# EAGLE schematic DIS07050H-V2.0-20231201 (EAGLE 9.5.1)
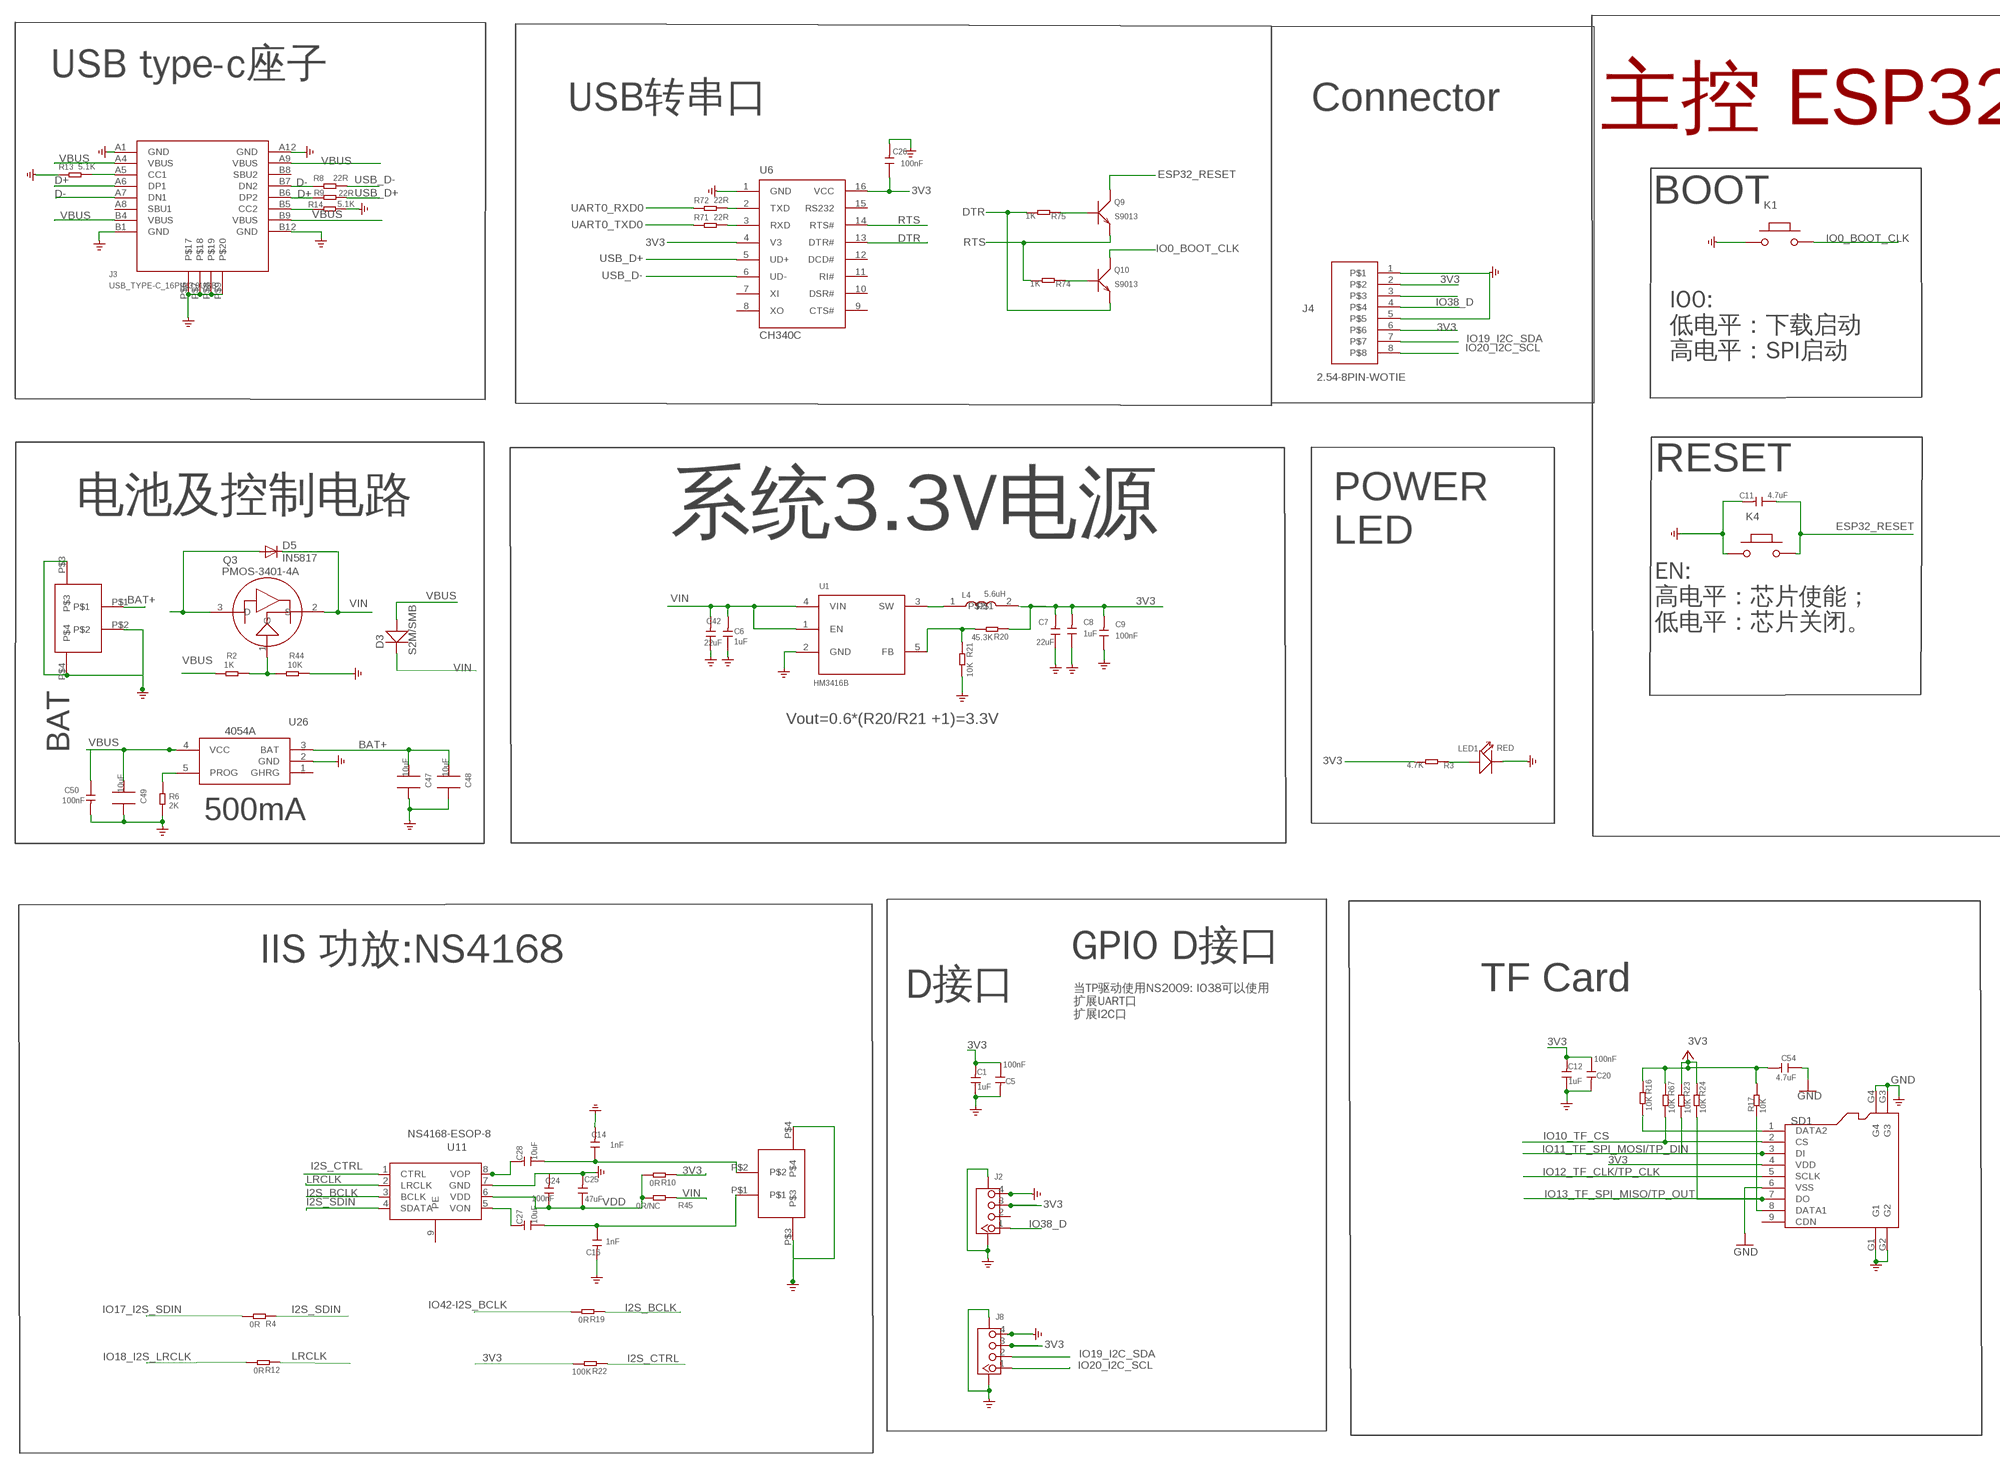
[diagram p0: schematic, sheet 1, part 1 of 2]
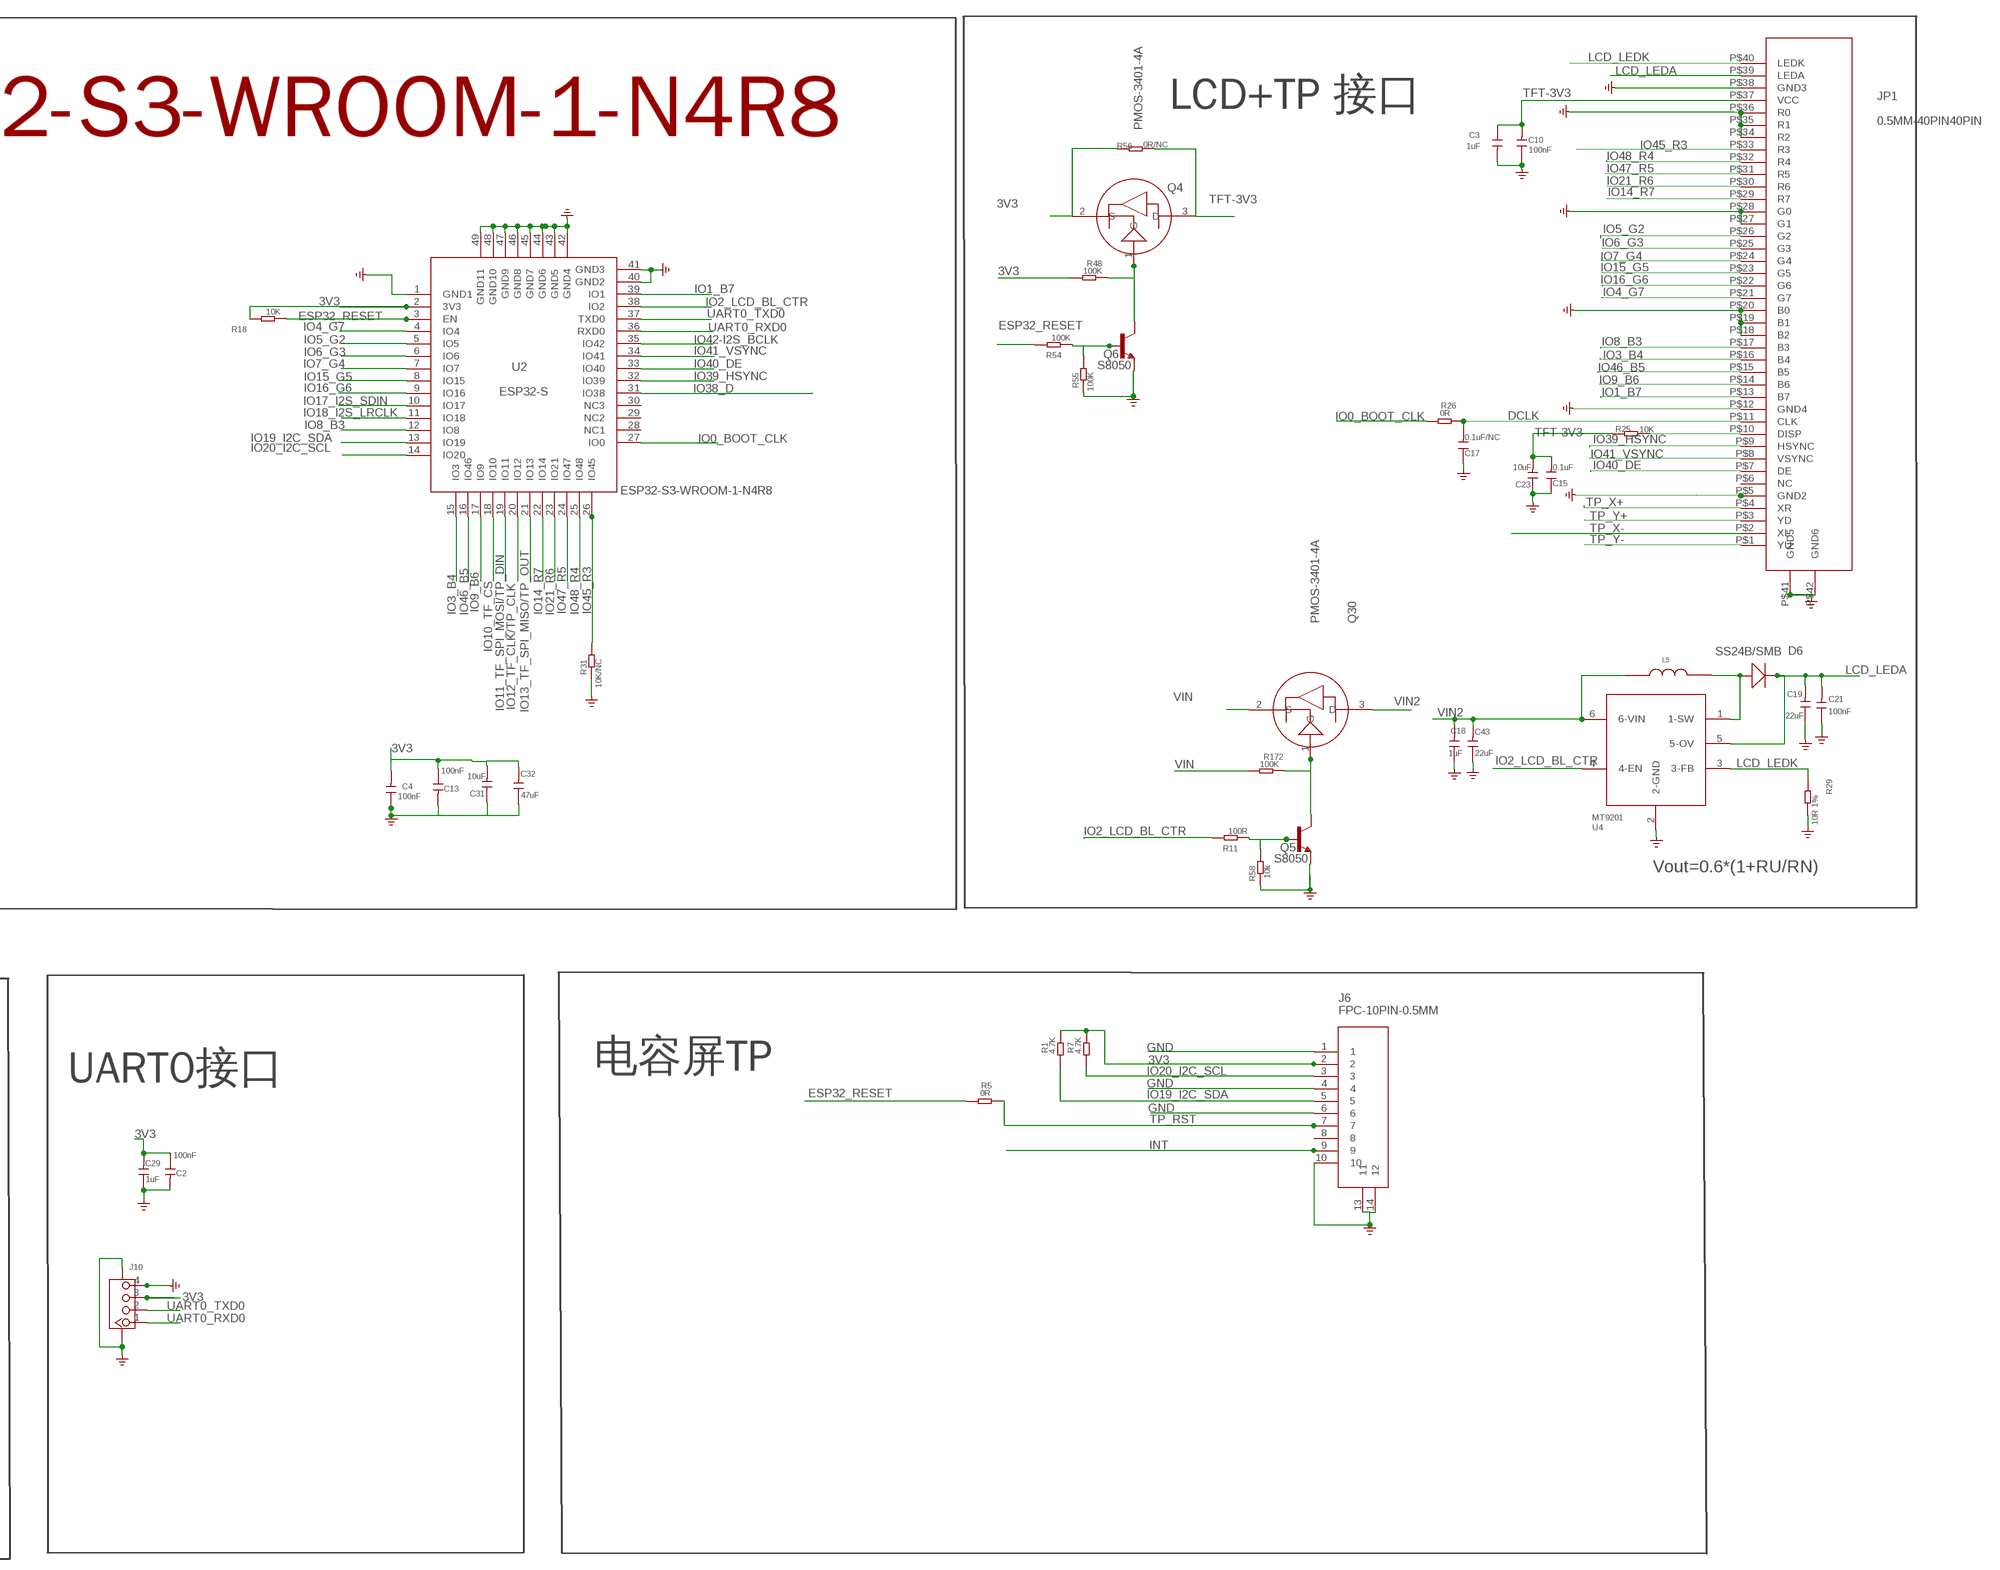
[diagram p1: schematic, sheet 1, part 2 of 2]

## Parts
C1  1uF  DISCRETE_C-0603  [DISCRETE_C0603]
C2  100nF  C-0603  [C0603]
C3  1uF  C-0603  [C0603]
C4  100nF  C-0603  [C0603]
C5  100nF  C-0603  [C0603]
C6  1uF  C0603  [0603]
C7  22uF  C0805  [0805]
C8  1uF  C0603  [0603]
C9  100nF  C0603  [0603]
C10  100nF  C-0603  [C0603]
C11  4.7uF  C0603  [0603]
C12  1uF  DISCRETE_C-0603  [DISCRETE_C0603]
C13  100nF  C-0603  [C0603]
C14  1nF  C-0603  [C0603]
C15  0.1uF  DISCRETE_C-0603  [DISCRETE_C0603]
C16  1nF  C-0603  [C0603]
C17  0.1uF/NC  DISCRETE_C-0603  [DISCRETE_C0603]
C18  1uF  C0603  [0603]
C19  22uF  C0805  [0805]
C20  100nF  C-0603  [C0603]
C21  100nF  C0603  [0603]
C23  10uF  DISCRETE_C-0603  [DISCRETE_C0603]
C24  100nF  C-0603  [C0603]
C25  47uF  C0805  [0805]
C26  100nF  C0603  [0603]
C27  10uF  DISCRETE_C-0603  [DISCRETE_C0603]
C28  10uF  DISCRETE_C-0603  [DISCRETE_C0603]
C29  1uF  DISCRETE_C-0603  [DISCRETE_C0603]
C31  10uF  DISCRETE_C-0603  [DISCRETE_C0603]
C32  47uF  C0805  [0805]
C42  22uF  C0805  [0805]
C43  22uF  C0805  [0805]
C47  10uF  C0805_S  [0805_S]
C48  10uF  C0805_S  [0805_S]
C49  10uF  C0805_S  [0805_S]
C50  100nF  C-0603  [C0603]
C54  4.7uF  DISCRETE_C-0603  [DISCRETE_C0603]
D3  S2M/SMB  214ABDO-214AB  [214AB]
D5  IN5817  DIODE-DO-214AC  [DO-214AC]
D6  SS24B/SMB  214ABDO-214AB  [214AB]
J1  PH2.0WT-2PIN  [PH2.0WT-2PIN]
J2  CONNECTOR_TWIG-4P-2.0-SMD-FEMALE-REINFORCE90D  [CONNECTOR_4P-SMD-2.0-90D]
J3  USB_TYPE-C_16PIN3.0USB  [KEVIN_3.0TYPEC-SMD]
J4  2.54-8PIN-WOTIE  [2.54-8P-WOTIE]
J5  PH2.0WT-2PIN  [PH2.0WT-2PIN]
J6  FPC-10PIN-0.5MM  [FPC-10PIN-0.5MM]
J8  CONNECTOR_TWIG-4P-2.0-SMD-FEMALE-REINFORCE90D  [CONNECTOR_4P-SMD-2.0-90D]
J10  CONNECTOR_TWIG-4P-2.0-SMD-FEMALE-REINFORCE90D  [CONNECTOR_4P-SMD-2.0-90D]
JP1  0.5MM-40PIN40PIN  [0.5MM*40P]
K1  BUTTON  PB157  [157SW]
K4  BUTTON  PB157  [157SW]
L4  5.6uH  L-0530  [CD54_CD54]
L5  CD32_6.8uH  CD32_950MA  [CD32]
LED1  RED  DISCRETE_LED0603  [DISCRETE_LED-0603]
Q3  PMOS-3401-4A  P-MOS-SOT23  [SOT-23]
Q4  PMOS-3401-4A  P-MOS-SOT23  [SOT-23]
Q5  S8050  SPARKFUN_TRANSISTOR_NPNSOT23  [SPARKFUN_SOT23]
Q6  S8050  SPARKFUN_TRANSISTOR_NPNSOT23  [SPARKFUN_SOT23]
Q9  S9013  TRANSISTOR-NPN-SOT23  [SOT23@1]
Q10  S9013  TRANSISTOR-NPN-SOT23  [SOT23@1]
Q30  PMOS-3401-4A  P-MOS-SOT23  [SOT-23]
R1  4.7K  R-0603  [R0603]
R2  1K  DISCRETE_R-0603  [DISCRETE_R0603]
R3  4.7K  DISCRETE_R-0603  [DISCRETE_R0603]
R4  0R  DISCRETE_R-0603  [DISCRETE_R0603]
R5  0R  R-0603  [R0603]
R6  2K  DISCRETE_R-0603  [DISCRETE_R0603]
R7  4.7K  R-0603  [R0603]
R8  22R  DISCRETE_R-0603  [DISCRETE_R0603]
R9  22R  DISCRETE_R-0603  [DISCRETE_R0603]
R10  0R  DISCRETE_R-0603  [DISCRETE_R0603]
R11  100R  R0603  [R0603]
R12  0R  DISCRETE_R-0603  [DISCRETE_R0603]
R13  5.1K  DISCRETE_R-0603  [DISCRETE_R0603]
R14  5.1K  DISCRETE_R-0603  [DISCRETE_R0603]
R16  10K  DISCRETE_R-0603  [DISCRETE_R0603]
R17  10K  DISCRETE_R-0603  [DISCRETE_R0603]
R18  10K  DISCRETE_R-0603  [DISCRETE_R0603]
R19  0R  DISCRETE_R-0603  [DISCRETE_R0603]
R20  45.3K  DISCRETE_R-0603  [DISCRETE_R0603]
R21  10K  DISCRETE_R-0603  [DISCRETE_R0603]
R22  100K  DISCRETE_R-0603  [DISCRETE_R0603]
R23  10K  DISCRETE_R-0603  [DISCRETE_R0603]
R24  10K  DISCRETE_R-0603  [DISCRETE_R0603]
R25  10K  DISCRETE_R-0603  [DISCRETE_R0603]
R26  0R  R-0603  [R0603]
R29  10R 1%  DISCRETE_R-0603  [DISCRETE_R0603]
R31  10K/NC  R0603  [R0603]
R44  10K  DISCRETE_R-0603  [DISCRETE_R0603]
R45  0R/NC  DISCRETE_R-0603  [DISCRETE_R0603]
R48  100K  R-0603  [R0603]
R54  100K  R0603  [R0603]
R55  100K  R0603  [R0603]
R56  0R/NC  DISCRETE_R-0603  [DISCRETE_R0603]
R58  10k  R0603  [R0603]
R67  10K  DISCRETE_R-0603  [DISCRETE_R0603]
R71  22R  DISCRETE_R-0603  [DISCRETE_R0603]
R72  22R  DISCRETE_R-0603  [DISCRETE_R0603]
R74  1K  DISCRETE_R-0603  [DISCRETE_R0603]
R75  1K  DISCRETE_R-0603  [DISCRETE_R0603]
R172  100K  R-0603  [R0603]
SD1  HOLDER-MICROSD-9P  [9P-SMD-W/-RING]
U1  HM3416B  A_XBJ_HM3420B  [A_XBJ_SOT23-5]
U2  ESP32-S  [ESP32-S3]
U4  MT9201  [SOT23-6]
U6  CH340C  CH340G  [SOP-16]
U11  NS4168-ESOP-8  [NS4168-ESOP-8]
U26  4054A  [SOP23-5]

## Nets
3V3: C1.2 C2.1 C4.2 C5.1 C7.2 C8.2 C9.2 C12.2 C13.1 C20.1 C26.1 C29.2 C31.2 C32.2 C54.2 J2.3 J4.2 J4.6 J6.2 J8.3 J10.3 L4.2 Q4.2(S) R1.2 R3.2 R7.2 R10.1 R16.1 R17.1 R18.1 R20.1 R22.2 R23.1 R24.1 R48.1 R56.1 R67.1 SD1.4(VDD) U2.2(3V3) U6.4(V3) U6.16(VCC) ; supply symbol labelled +3V3
BAT+: C47.2 C48.2 D5.A J1.P$1 Q3.3(D) U26.3(BAT)
D+: J3.A6(DP1) J3.B6(DP2) R9.1
D-: J3.A7(DN1) J3.B7(DN2) R8.1
DCLK: C17.2 JP1.P$11(CLK) R26.2
DTR: Q10.2(E) R75.2 U6.13(DTR#)
ESP32_RESET: C11.1 K4.2 Q9.3(C) R5.1 R18.2 R54.2 U2.3(EN)
GND: C1.1 C2.2 C3.2 C4.1 C5.2 C6.1 C7.1 C8.1 C9.1 C10.1 C11.2 C12.1 C13.2 C14.2 C15.1 C16.2 C17.1 C18.1 C19.1 C20.2 C21.1 C23.1 C24.2 C25.2 C26.2 C29.1 C31.1 C32.1 C42.1 C43.1 C47.1 C48.1 C49.1 C50.2 C54.1 J1.P$2 J1.P$3 J1.P$4 J2.4 J2.SS1 J2.SS2 J3.A1(GND) J3.A12(GND) J3.B1(GND) J3.B12(GND) J3.P$6 J3.P$7 J3.P$8 J3.P$9 J4.1 J4.5 J5.P$3 J5.P$4 J6.1 J6.4 J6.6 J6.10 J6.13 J6.14 J8.4 J8.SS1 J8.SS2 J10.4 J10.SS1 J10.SS2 JP1.P$5(GND2) JP1.P$12(GND4) JP1.P$18(B2) JP1.P$19(B1) JP1.P$20(B0) JP1.P$27(G1) JP1.P$28(G0) JP1.P$34(R2) JP1.P$35(R1) JP1.P$36(R0) JP1.P$38(GND3) JP1.P$41(GND5) JP1.P$42(GND6) K1.1 K4.1 LED1.- Q5.2(E) Q6.2(E) R6.2 R13.1 R14.2 R21.2 R29.2 R31.1 R44.1 R55.1 R58.1 SD1.6(VSS) SD1.G1 SD1.G2 SD1.G3 SD1.G4 U1.2(GND) U2.1(GND1) U2.40(GND2) U2.41(GND3) U2.42(GND4) U2.43(GND5) U2.44(GND6) U2.45(GND7) U2.46(GND8) U2.47(GND9) U2.48(GND10) U2.49(GND11) U4.2(2-GND) U6.1(GND) U11.7(GND) U26.2(GND)
I2S_BCLK: R19.1 U11.3(BCLK)
I2S_CTRL: R22.1 U11.1(CTRL)
I2S_SDIN: R4.1 U11.4(SDATA)
INT: J6.9
IO0_BOOT_CLK: K1.2 Q10.3(C) R26.1 U2.27(IO0)
IO1_B7: JP1.P$13(B7) U2.39(IO1)
IO2_LCD_BL_CTR: R11.2 U2.38(IO2) U4.4(4-EN)
IO3_B4: JP1.P$16(B4) U2.15(IO3)
IO4_G7: JP1.P$21(G7) U2.4(IO4)
IO5_G2: JP1.P$26(G2) U2.5(IO5)
IO6_G3: JP1.P$25(G3) U2.6(IO6)
IO7_G4: JP1.P$24(G4) U2.7(IO7)
IO8_B3: JP1.P$17(B3) U2.12(IO8)
IO9_B6: JP1.P$14(B6) U2.17(IO9)
IO10_TF_CS: R67.2 SD1.2(CS) U2.18(IO10)
IO11_TF_SPI_MOSI/TP_DIN: R23.2 SD1.3(DI) U2.19(IO11)
IO12_TF_CLK/TP_CLK: SD1.5(SCLK) U2.20(IO12)
IO13_TF_SPI_MISO/TP_OUT: R24.2 SD1.7(DO) U2.21(IO13)
IO14_R7: JP1.P$29(R7) U2.22(IO14)
IO15_G5: JP1.P$23(G5) U2.8(IO15)
IO16_G6: JP1.P$22(G6) U2.9(IO16)
IO17_I2S_SDIN: R4.2 U2.10(IO17)
IO18_I2S_LRCLK: R12.2 U2.11(IO18)
IO19_I2C_SDA: J4.7 J6.5 J8.2 R1.1 U2.13(IO19)
IO20_I2C_SCL: J4.8 J6.3 J8.1 R7.1 U2.14(IO20)
IO21_R6: JP1.P$30(R6) U2.23(IO21)
IO38_D: J2.1 J4.4 U2.31(IO38)
IO39_HSYNC: JP1.P$9(HSYNC) U2.32(IO39)
IO40_DE: JP1.P$7(DE) U2.33(IO40)
IO41_VSYNC: JP1.P$8(VSYNC) U2.34(IO41)
IO42-I2S_BCLK: R19.2 U2.35(IO42)
IO45_R3: JP1.P$33(R3) R31.2 U2.26(IO45)
IO46_B5: JP1.P$15(B5) U2.16(IO46)
IO47_R5: JP1.P$31(R5) U2.24(IO47)
IO48_R4: JP1.P$32(R4) U2.25(IO48)
LCD_LEDA: C19.2 C21.2 D6.2(-) JP1.P$39(LEDA) U4.5(5-OV)
LCD_LEDK: JP1.P$40(LEDK) R29.1 U4.3(3-FB)
LRCLK: R12.1 U11.2(LRCLK)
N$1: LED1.+ R3.1
N$2: C27.2 U11.5(VON)
N$3: C14.1 C28.1 J5.P$2
N$7: JP1.P$10(DISP) R25.2
N$8: C28.2 U11.8(VOP)
N$11: J3.A5(CC1) R13.2
N$13: L4.1 U1.3(SW)
N$15: C16.1 C27.1 J5.P$1
N$16: D6.1(+) L5.2 U4.1(1-SW)
N$17: J3.B5(CC2) R14.1
N$20: R20.2 R21.1 U1.5(FB)
N$21: Q3.1(G) R2.1 R44.2
N$22: R6.1 U26.5(PROG)
N$23: Q5.1(B) R11.1 R58.2
N$27: Q4.1(G) Q6.3(C) R48.2
N$28: J4.3
N$32: Q9.1(B) R75.1
N$33: Q6.1(B) R54.1 R55.2
N$36: Q5.3(C) Q30.1(G) R172.2
N$38: Q10.1(B) R74.1
N$40: R72.2 U6.2(TXD)
N$42: R71.2 U6.3(RXD)
N$47: R16.2 SD1.1(DATA2)
N$48: R17.2 SD1.8(DATA1)
RTS: Q9.2(E) R74.2 U6.14(RTS#)
TFT-3V3: C3.1 C10.2 C15.2 C23.2 JP1.P$37(VCC) Q4.3(D) R25.1 R56.2
TP_RST: J6.7 R5.2
TP_X+: JP1.P$4(XR)
TP_X-: JP1.P$2(XL)
TP_Y+: JP1.P$3(YD)
TP_Y-: JP1.P$1(YU)
UART0_RXD0: J10.1 R72.1 U2.36(RXD0)
UART0_TXD0: J10.2 R71.1 U2.37(TXD0)
USB_D+: R9.2 U6.5(UD+)
USB_D-: R8.2 U6.6(UD-)
VBUS: C49.2 C50.1 D3.1(+) J3.A4(VBUS) J3.A9(VBUS) J3.B4(VBUS) J3.B9(VBUS) R2.2 U26.4(VCC)
VDD: C24.1 C25.1 R10.2 R45.2 U11.6(VDD)
VIN: C6.2 C42.2 D3.2(-) D5.C Q3.2(S) Q30.2(S) R45.1 R172.1 U1.1(EN) U1.4(VIN)
VIN2: C18.2 C43.2 L5.1 Q30.3(D) U4.6(6-VIN)
Unconnected: J2.2 J3.A8(SBU1) J3.B8(SBU2) J6.8 JP1.P$6(NC) SD1.9(CDN) U2.28(NC1) U2.29(NC2) U2.30(NC3) U6.7(XI) U6.8(XO) U6.9(CTS#) U6.10(DSR#) U6.11(RI#) U6.12(DCD#) U6.15(RS232) U11.9(PE) U26.1(GHRG)

## Notes on the sheet
- USB type-c座子
- USB转串口 | Connector | LCD+TP 接口
- 主控 ESP32-S3-WROOM-1-N4R8
- BOOT
- IO0:
  低电平：下载启动
  高电平：SPI启动
- RESET
- 电池及控制电路
- 系统3.3V电源
- POWER
  LED
- EN:
  高电平：芯片使能；
  低电平：芯片关闭。
- Vout=0.6*(R20/R21 +1)=3.3V
- BAT
- Vout=0.6*(1+RU/RN)
- 500mA
- IIS 功放:NS4168 | GPIO D接口
- TF Card | UART0接口 | 电容屏TP
- D接口
- 当TP驱动使用NS2009: IO38可以使用
  扩展UART口
  扩展I2C口

## Library data of the parts
C1 C12 C27-C29 = A_xbj:DISCRETE_C*: Ceramic Capacitors
C2-C5 C10 C13 C14 C16 C20 C24 C50 = discrete:C*: Ceramic Capacitors
C6 C8 C9 C11 C18 C21 C26 = A_xbj:C0603
C7 C19 C25 C32 C42 C43 = A_xbj:C0805
C15 C17 C23 C31 C54 = A9G:DISCRETE_C*: Ceramic Capacitors
C47-C49 = CPT_SMD:C0805
D3 D6 = DO-214AB:214AB: 214AB
D5 = diode:DIODE-: DIODE
J1 J5 = cooper:PH2.0WT-2PIN
J2 J8 J10 = A_xbj:CONNECTOR_TWIG-4P-2.0-SMD-FEMALE-REINFORCE
J3 = WZ3532R024-ESP32-V0.1-20221226:USB_TYPE-C_16PIN
J4 = cooper:2.54-8PIN-WOTIE
J6 = cooper:FPC-10PIN-0.5MM
JP1 = cooper:0.5MM-40PIN
K1 K4 = MySMD:PB157
L4 = WZ2432R028-ESP32-V1.2-20231108:L-0530
L5 = CD54:CD32_950MA
LED1 = A_xbj:DISCRETE_LED*
Q3 Q4 Q30 = DFN8:P-MOS-SOT23
Q5 Q6 = Adafruit_HUZZAH32_ESP32_Feather:SPARKFUN_TRANSISTOR_NPN: Transistor NPN BJT configuration in SOT23 package. MMBT2222 is the common NPN we use. Double check BCE configuration again layout.
Q9 Q10 = discrete:TRANSISTOR-NPN*: NPN audion
R1 R5 R7 R26 R48 R172 = discrete:R*
R2 R6 R44 = A9G:DISCRETE_R*
R3 R4 R8-R10 R12-R14 R16-R25 R29 R45 R56 R67 R71 R72 R74 R75 = Crowtail-_LED-V2.0-20190615-01:DISCRETE_R*
R11 R31 R54 R55 R58 = cooper:R0603
SD1 = Connector:HOLDER-MICROSD-9P
U1 = CrowBot_-V1.0-20220525:A_XBJ_HM3420B
U2 = DW1000:ESP32-S; U2: ESP32-S3-WROOM-1-N4R8
U4 = cooper:MT9201
U6 = A_xbj:CH340G
U11 = STC_MCUSTC8G1K08A:NS4168-ESOP-8
U26 = DFN8:4054A

## Net classes
0 default: width 0.152 mm, drill 0.305 mm, clearance 0.203 mm